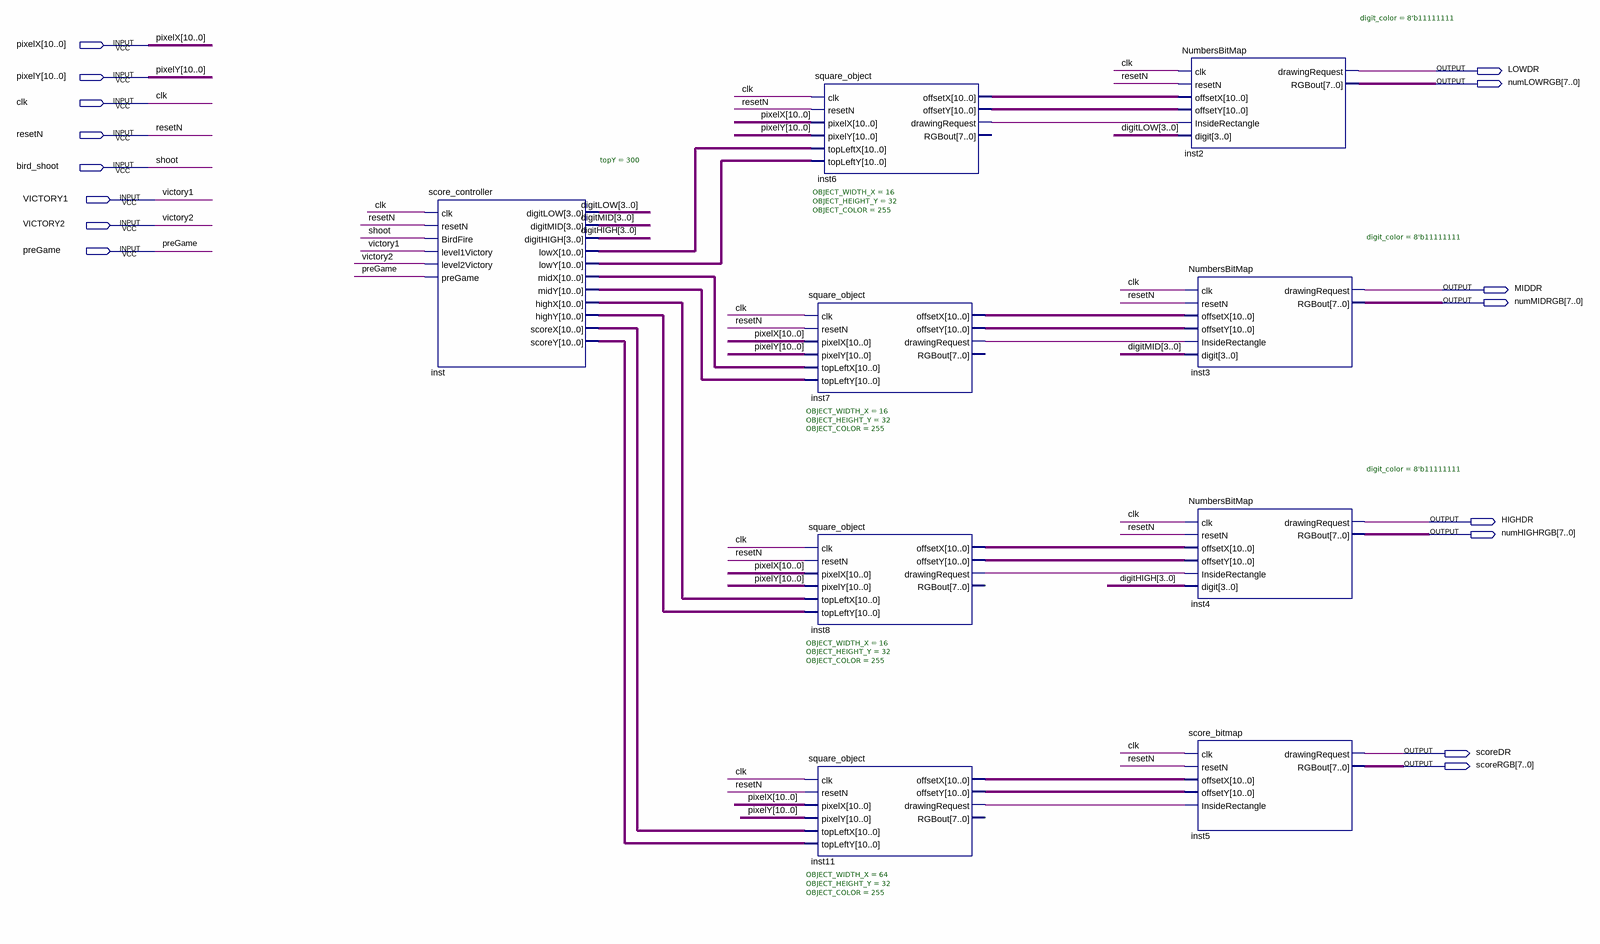
[diagram p0: schematic sheet]
// Quartus schematic Score_Block_T.bdf as structural Verilog: 9 symbols, 16 pins
module Score_Block_T (
  input  [10:0] pixelX,
  input  [10:0] pixelY,
  input  clk,
  input  resetN,
  input  bird_shoot,
  input  VICTORY1,
  input  VICTORY2,
  input  preGame,
  output LOWDR,
  output [7:0] numLOWRGB,
  output MIDDR,
  output [7:0] numMIDRGB,
  output HIGHDR,
  output [7:0] numHIGHRGB,
  output scoreDR,
  output [7:0] scoreRGB
);

  wire inst6_drawingrequest, inst7_drawingrequest, inst8_drawingrequest, inst11_drawingrequest;
  wire [3:0] digitHIGH, digitLOW, digitMID;
  wire [10:0] inst6_offsetx, inst6_offsety, inst7_offsetx, inst7_offsety, inst8_offsetx, inst8_offsety,
       inst11_offsetx, inst11_offsety, inst_highx, inst_highy, inst_lowx, inst_lowy, inst_midx, inst_midy,
       inst_scorex, inst_scorey;

  score_controller #(.topY(300)) inst (
    .clk(clk), .resetN(resetN), .BirdFire(bird_shoot), .level1Victory(VICTORY1), .level2Victory(VICTORY2),
    .preGame(preGame), .digitLOW(digitLOW), .digitMID(digitMID), .digitHIGH(digitHIGH), .lowX(inst_lowx),
    .lowY(inst_lowy), .midX(inst_midx), .midY(inst_midy), .highX(inst_highx), .highY(inst_highy),
    .scoreX(inst_scorex), .scoreY(inst_scorey));
  square_object #(.OBJECT_WIDTH_X(16), .OBJECT_HEIGHT_Y(32), .OBJECT_COLOR(255)) inst6 (
    .clk(clk), .resetN(resetN), .pixelX(pixelX), .pixelY(pixelY), .topLeftX(inst_lowx), .topLeftY(inst_lowy),
    .offsetX(inst6_offsetx), .offsetY(inst6_offsety), .drawingRequest(inst6_drawingrequest));  // open: RGBout
  square_object #(.OBJECT_WIDTH_X(16), .OBJECT_HEIGHT_Y(32), .OBJECT_COLOR(255)) inst7 (
    .clk(clk), .resetN(resetN), .pixelX(pixelX), .pixelY(pixelY), .topLeftX(inst_midx), .topLeftY(inst_midy),
    .offsetX(inst7_offsetx), .offsetY(inst7_offsety), .drawingRequest(inst7_drawingrequest));  // open: RGBout
  square_object #(.OBJECT_WIDTH_X(16), .OBJECT_HEIGHT_Y(32), .OBJECT_COLOR(255)) inst8 (
    .clk(clk), .resetN(resetN), .pixelX(pixelX), .pixelY(pixelY), .topLeftX(inst_highx),
    .topLeftY(inst_highy), .offsetX(inst8_offsetx), .offsetY(inst8_offsety),
    .drawingRequest(inst8_drawingrequest));  // open: RGBout
  square_object #(.OBJECT_WIDTH_X(64), .OBJECT_HEIGHT_Y(32), .OBJECT_COLOR(255)) inst11 (
    .clk(clk), .resetN(resetN), .pixelX(pixelX), .pixelY(pixelY), .topLeftX(inst_scorex),
    .topLeftY(inst_scorey), .offsetX(inst11_offsetx), .offsetY(inst11_offsety),
    .drawingRequest(inst11_drawingrequest));  // open: RGBout
  NumbersBitMap #(.digit_color(8'b11111111)) inst2 (
    .clk(clk), .resetN(resetN), .offsetX(inst6_offsetx), .offsetY(inst6_offsety),
    .InsideRectangle(inst6_drawingrequest), .digit(digitLOW), .drawingRequest(LOWDR), .RGBout(numLOWRGB));
  NumbersBitMap #(.digit_color(8'b11111111)) inst3 (
    .clk(clk), .resetN(resetN), .offsetX(inst7_offsetx), .offsetY(inst7_offsety),
    .InsideRectangle(inst7_drawingrequest), .digit(digitMID), .drawingRequest(MIDDR), .RGBout(numMIDRGB));
  NumbersBitMap #(.digit_color(8'b11111111)) inst4 (
    .clk(clk), .resetN(resetN), .offsetX(inst8_offsetx), .offsetY(inst8_offsety),
    .InsideRectangle(inst8_drawingrequest), .digit(digitHIGH), .drawingRequest(HIGHDR), .RGBout(numHIGHRGB));
  score_bitmap inst5 (
    .clk(clk), .resetN(resetN), .offsetX(inst11_offsetx), .offsetY(inst11_offsety),
    .InsideRectangle(inst11_drawingrequest), .drawingRequest(scoreDR), .RGBout(scoreRGB));

  // Other names for the same wires on the sheet: shoot = bird_shoot
endmodule
